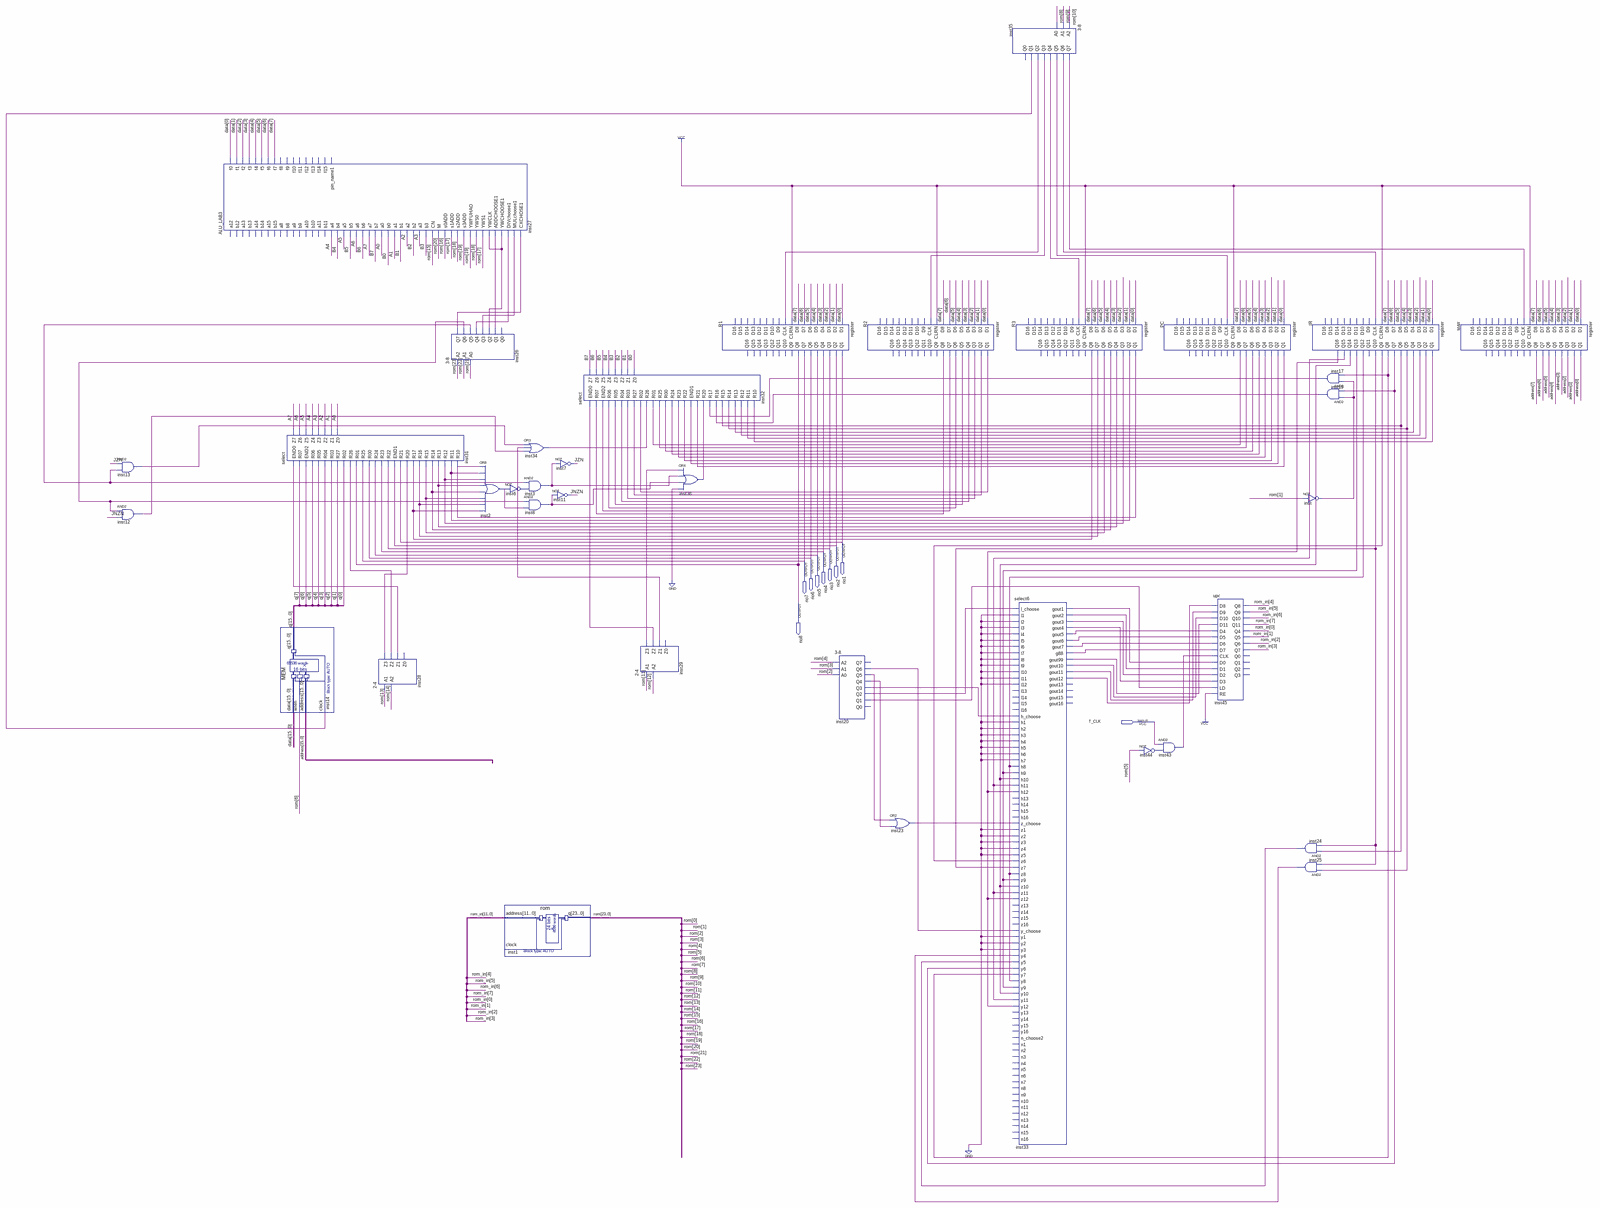
[diagram p0: schematic sheet, whole]
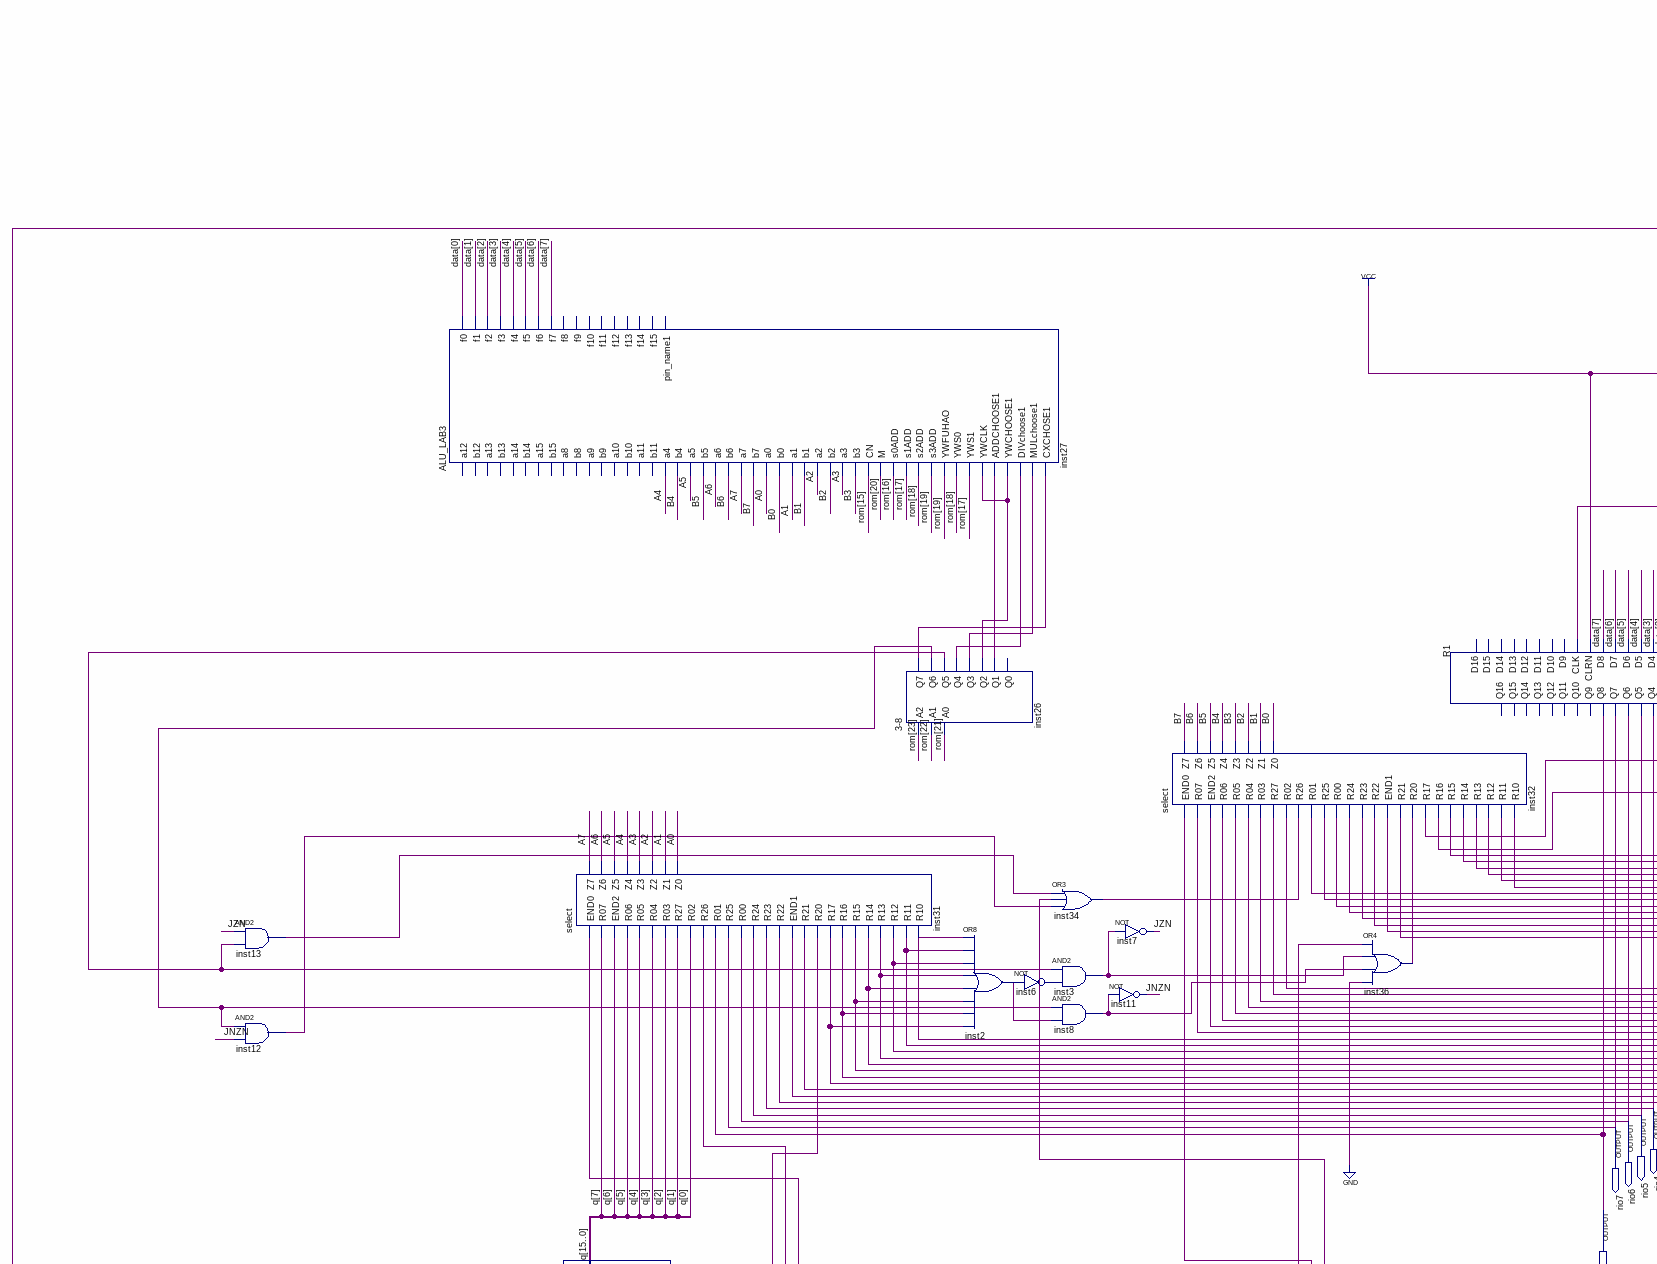
[diagram p1: schematic sheet, upper left part]
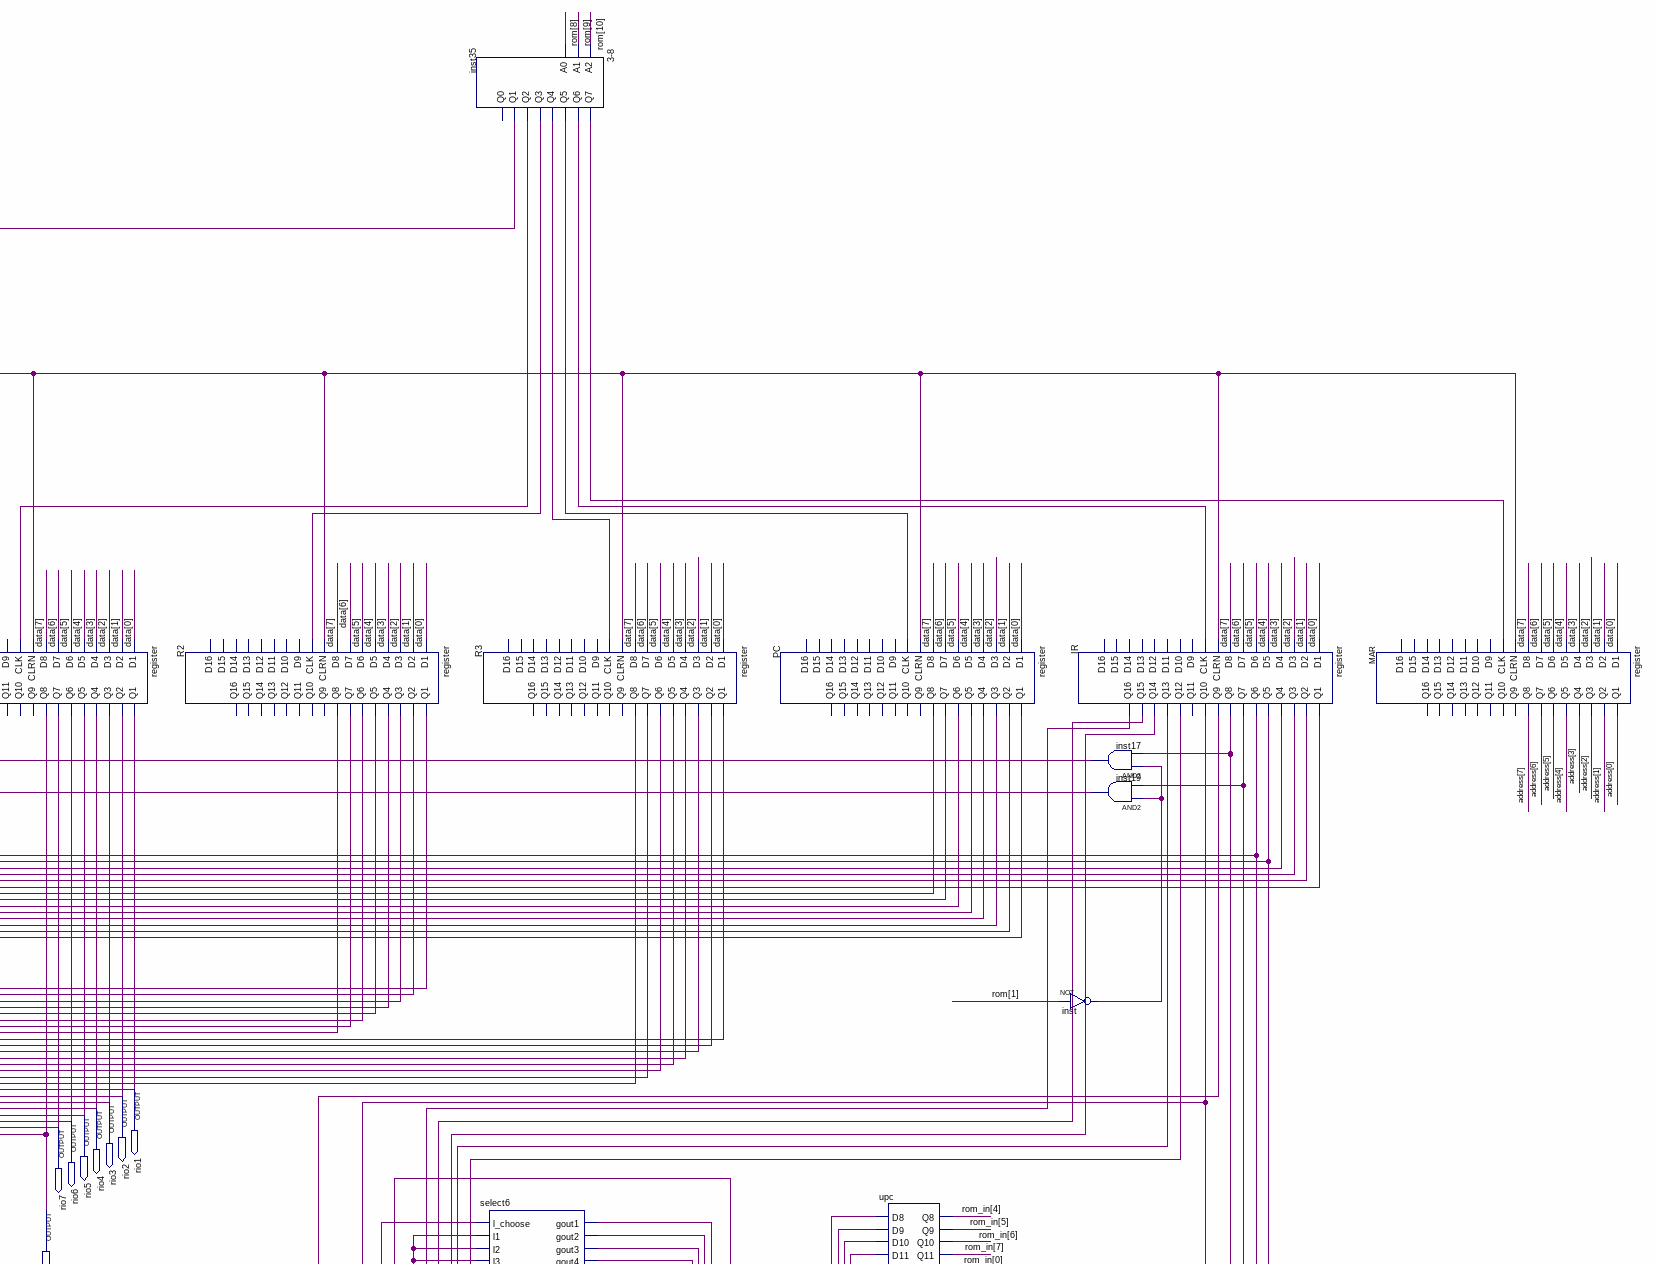
[diagram p2: schematic sheet, upper right part]
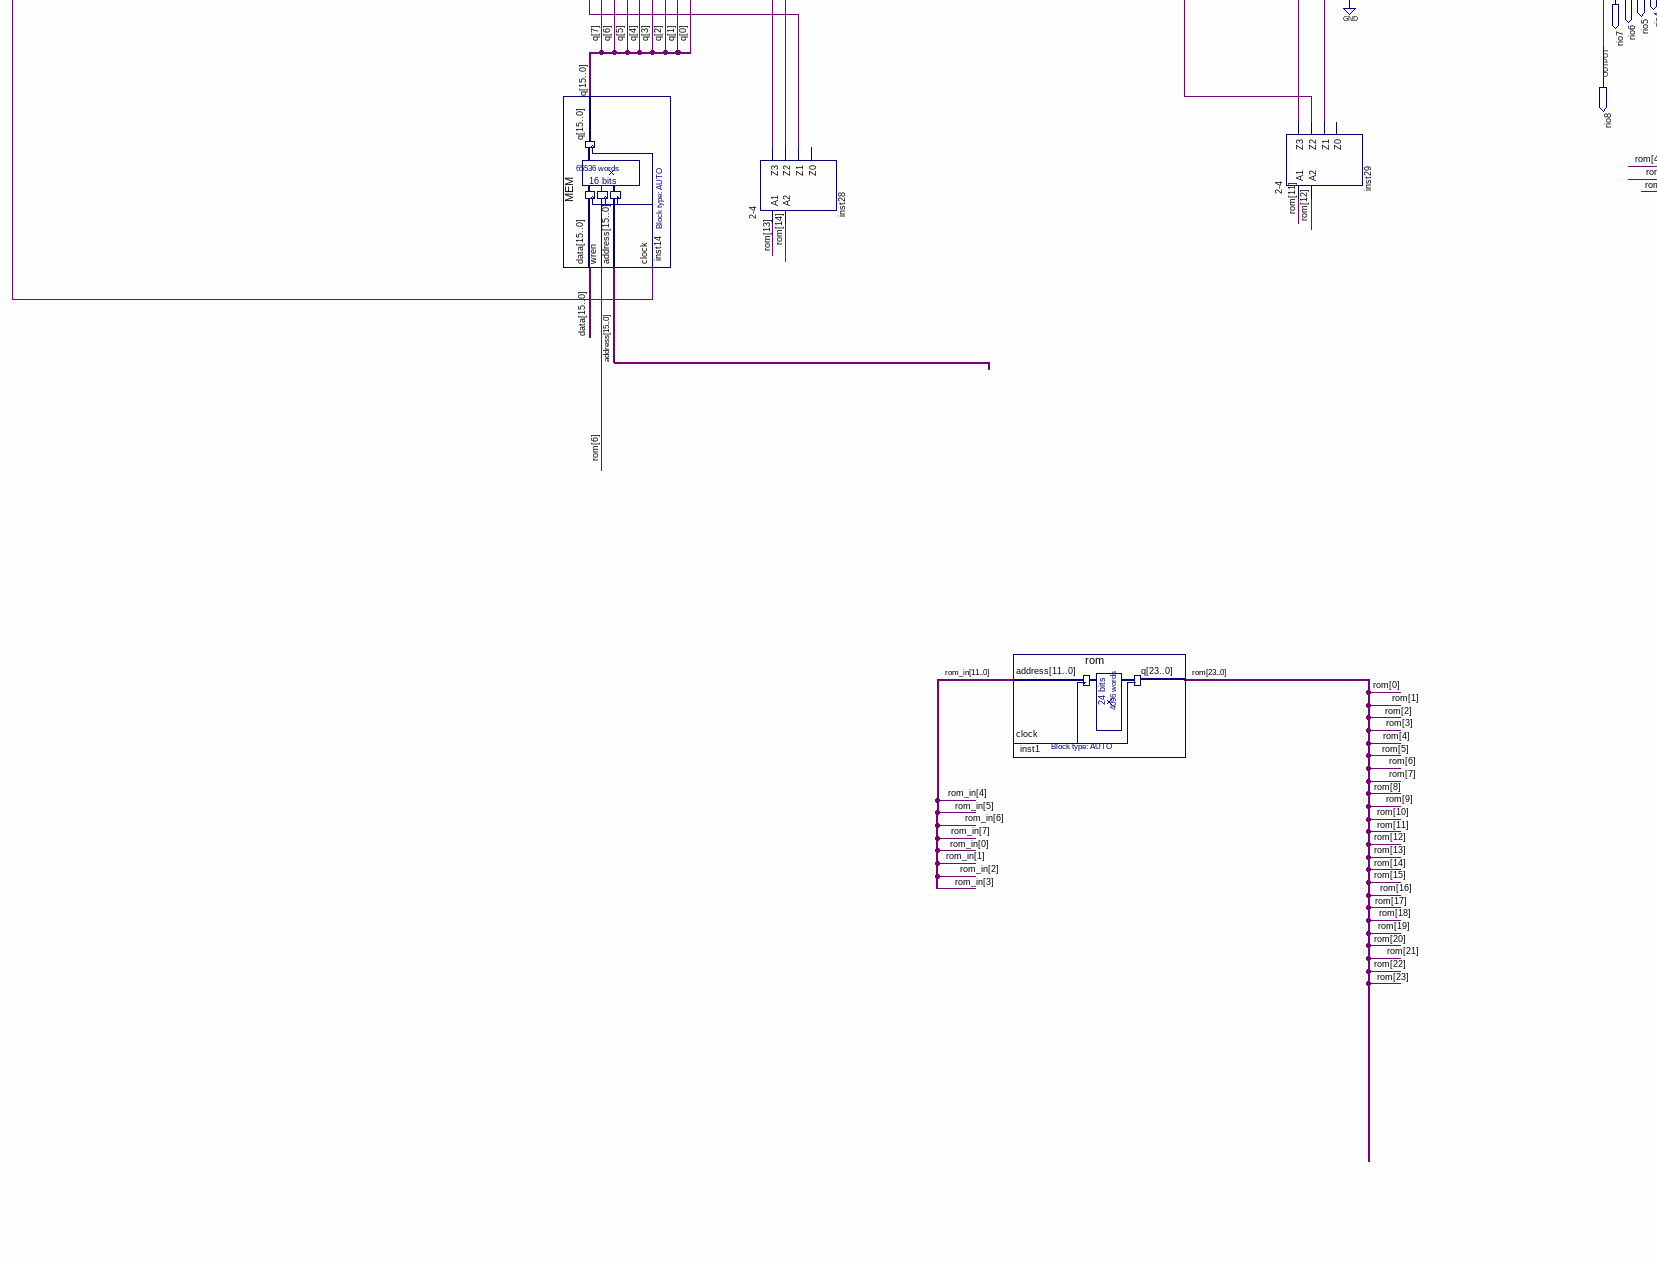
[diagram p3: schematic sheet, lower left part]
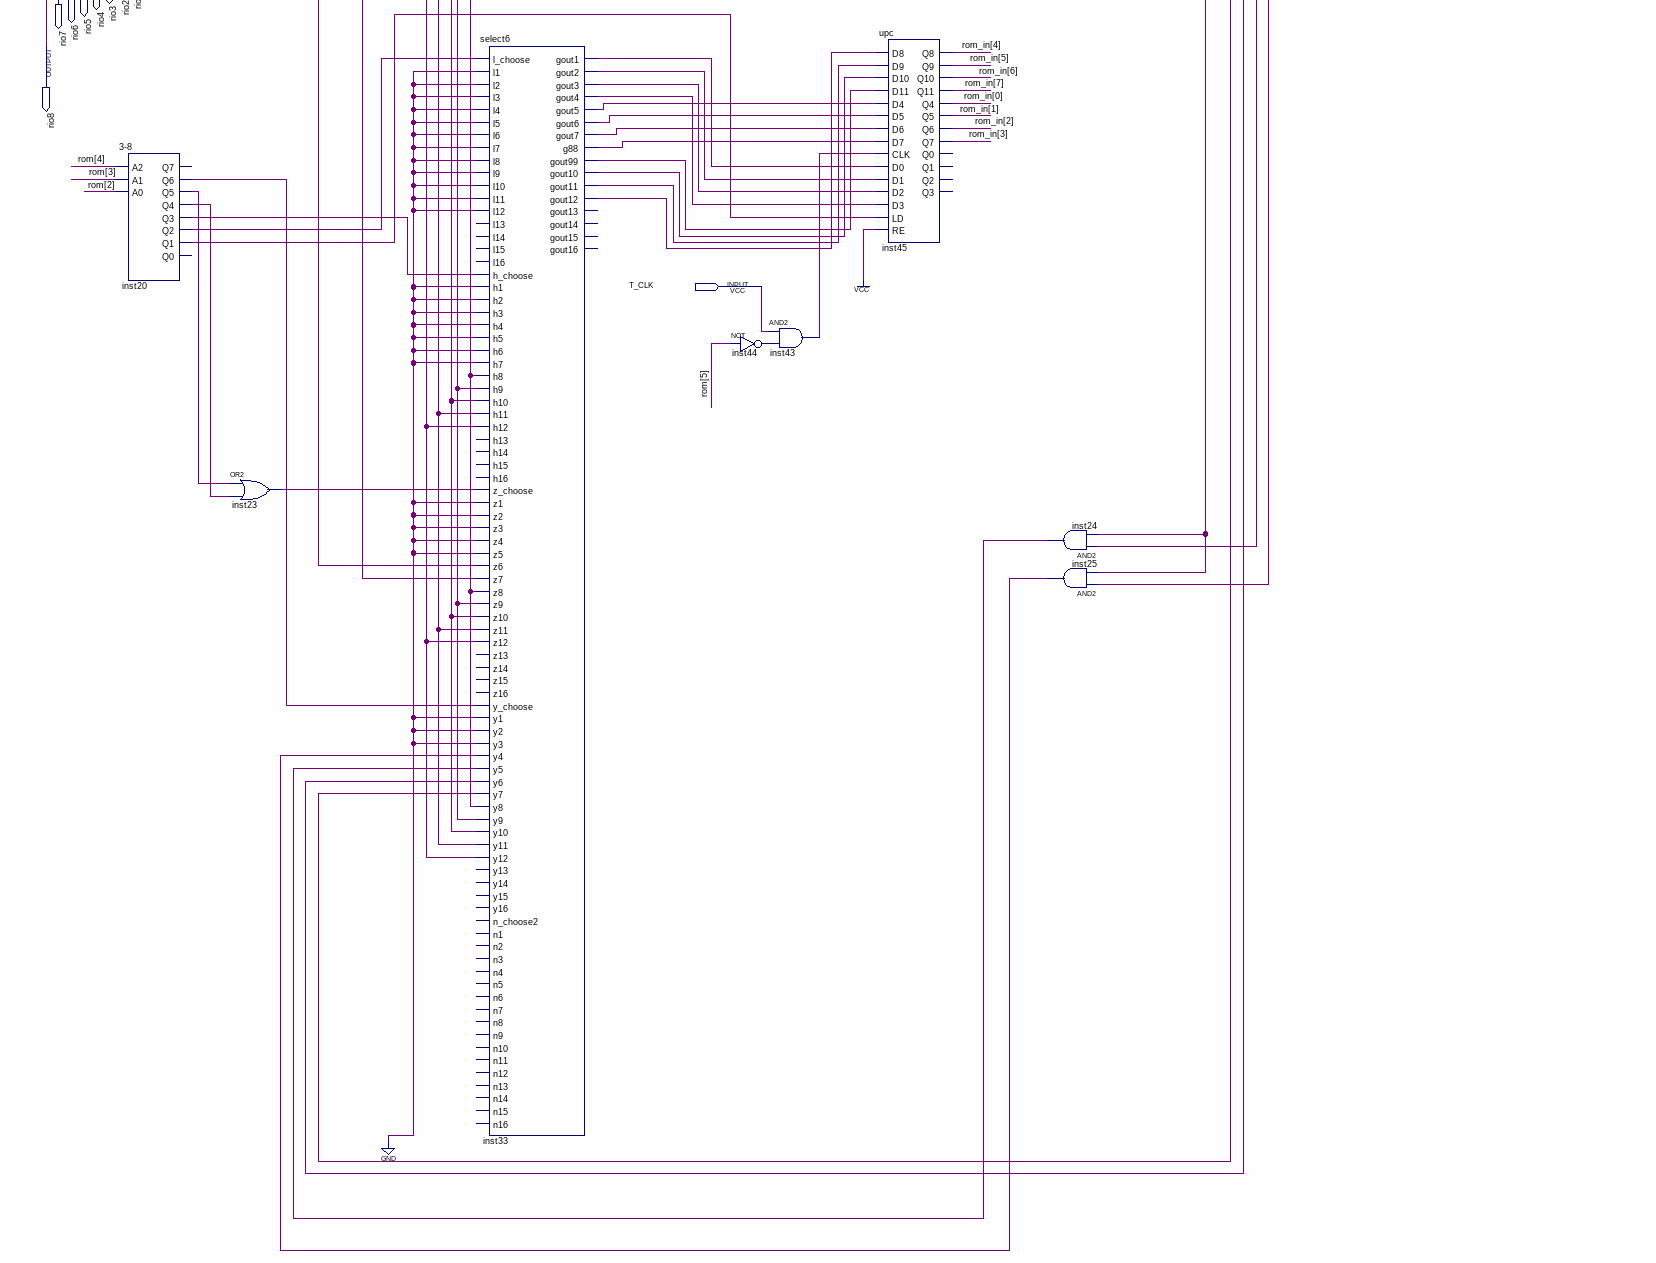
[diagram p4: schematic sheet, lower right part]
// Quartus schematic test3.bdf as structural Verilog: 36 symbols, 9 pins
module test3 (
  input  T_CLK,
  output rio1,
  output rio2,
  output rio3,
  output rio4,
  output rio5,
  output rio6,
  output rio7,
  output rio8
);

  wire A0, A1, A2, A3, A4, A5, A6, A7, B0, B1, B2, B3, B4, B5, B6, B7, inst2_out, inst3_out, inst6_out,
       inst8_out, inst12_out, inst13_out, inst17_out, inst19_out, inst20_q1, inst20_q2, inst20_q3, inst20_q4,
       inst20_q5, inst20_q6, inst23_out, inst24_out, inst25_out, inst26_q1, inst26_q2, inst26_q3, inst26_q4,
       inst26_q5, inst26_q6, inst26_q7, inst28_z1, inst28_z2, inst28_z3, inst29_z1, inst29_z2, inst29_z3,
       inst33_g88, inst33_gout1, inst33_gout2, inst33_gout3, inst33_gout4, inst33_gout5, inst33_gout6,
       inst33_gout7, inst33_gout10, inst33_gout11, inst33_gout12, inst33_gout99, inst34_out, inst35_q1,
       inst35_q2, inst35_q3, inst35_q4, inst35_q5, inst35_q6, inst35_q7, inst36_out, inst43_out, inst44_out,
       inst_out, IR_q1, IR_q2, IR_q3, IR_q4, IR_q5, IR_q6, IR_q7, IR_q8, IR_q9, IR_q10, IR_q12, IR_q13,
       IR_q14, IR_q15, IR_q16, JNZN, JZN, PC_q1, PC_q2, PC_q3, PC_q4, PC_q5, PC_q6, PC_q7, PC_q8, R2_q1,
       R2_q2, R2_q3, R2_q4, R2_q5, R2_q6, R2_q7, R2_q8, R3_q1, R3_q2, R3_q3, R3_q4, R3_q5, R3_q6, R3_q7,
       R3_q8;
  wire [11:0] rom_in;
  wire [15:0] address, data, q;
  wire [23:0] rom;

  and inst13 (inst13_out, JZN, inst26_q5);
  and inst12 (inst12_out, inst26_q6, JNZN);
  ALU_LAB3 inst27 (
    .a4(A4), .b4(B4), .a5(A5), .b5(B5), .a6(A6), .b6(B6), .a7(A7), .b7(B7), .a0(A0), .b0(B0), .a1(A1),
    .b1(B1), .a2(A2), .b2(B2), .a3(A3), .b3(B3), .CN(rom[15]), .M(rom[20]), .s0ADD(rom[16]), .s1ADD(rom[17]),
    .s2ADD(rom[18]), .s3ADD(rom[19]), .YWFUHAO(rom[19]), .YWS0(rom[18]), .YWS1(rom[17]), .YWCLK(inst26_q2),
    .ADDCHOOSE1(inst26_q1), .YWCHOOSE1(inst26_q2), .DIVchoose1(inst26_q4), .MULchoose1(inst26_q3),
    .CXCHOSE1(inst26_q7), .f0(data[0]), .f1(data[1]), .f2(data[2]), .f3(data[3]), .f4(data[4]), .f5(data[5]),
    .f6(data[6]), .f7(data[7]));  // open: a12, b12, a13, b13, a14, b14, a15, b15, a8, b8, a9, b9, a10, b10, a11, b11, f8, f9, f10, f11, f12, f13, f14, f15, pin_name1
  select inst31 (
    .END0(inst28_z1), .R07(q[7]), .END2(q[6]), .R06(q[5]), .R05(q[4]), .R04(q[3]), .R03(q[2]), .R27(q[1]),
    .R02(q[0]), .R26(inst28_z2), .R01(rio8), .R25(rio7), .R00(rio6), .R24(rio5), .R23(rio4), .R22(rio3),
    .END1(rio2), .R21(rio1), .R20(inst28_z3), .R17(R3_q8), .R16(R3_q7), .R15(R3_q6), .R14(R3_q5),
    .R13(R3_q4), .R12(R3_q3), .R11(R3_q2), .R10(R3_q1), .Z7(A7), .Z6(A6), .Z5(A5), .Z4(A4), .Z3(A3), .Z2(A2),
    .Z1(A1), .Z0(A0));
  MEM inst14 (.data(data), .wren(rom[6]), .address(address), .clock(inst35_q1), .q(q));
  \2-4  inst28 (.A1(rom[13]), .A2(rom[14]), .Z3(inst28_z3), .Z2(inst28_z2), .Z1(inst28_z1));  // open: Z0
  \3-8  inst26 (
    .A2(rom[23]), .A1(rom[22]), .A0(rom[21]), .Q7(inst26_q7), .Q6(inst26_q6), .Q5(inst26_q5), .Q4(inst26_q4),
    .Q3(inst26_q3), .Q2(inst26_q2), .Q1(inst26_q1));  // open: Q0
  or inst2 (inst2_out, R3_q1, R3_q2, R3_q3, R3_q4, R3_q5, R3_q6, R3_q7, R3_q8);
  not inst6 (inst6_out, inst2_out);
  rom inst1 (.address(rom_in), .q(rom));  // open: clock
  or inst34 (inst34_out, inst13_out, inst29_z1, inst12_out);
  and inst3 (inst3_out, inst26_q5, inst6_out);
  and inst8 (inst8_out, inst26_q6, inst2_out);
  not inst7 (JZN, inst3_out);
  not inst11 (JNZN, inst8_out);
  select inst32 (
    .END0(inst29_z2), .R07(R2_q8), .END2(R2_q7), .R06(R2_q6), .R05(R2_q5), .R04(R2_q4), .R03(R2_q3),
    .R27(R2_q2), .R02(R2_q1), .R26(inst34_out), .R01(PC_q8), .R25(PC_q7), .R00(PC_q6), .R24(PC_q5),
    .R23(PC_q4), .R22(PC_q3), .END1(PC_q2), .R21(PC_q1), .R20(inst36_out), .R17(inst17_out),
    .R16(inst19_out), .R15(IR_q6), .R14(IR_q5), .R13(IR_q4), .R12(IR_q3), .R11(IR_q2), .R10(IR_q1), .Z7(B7),
    .Z6(B6), .Z5(B5), .Z4(B4), .Z3(B3), .Z2(B2), .Z1(B1), .Z0(B0));
  \2-4  inst29 (.A1(rom[11]), .A2(rom[12]), .Z3(inst29_z3), .Z2(inst29_z2), .Z1(inst29_z1));  // open: Z0
  or inst36 (inst36_out, inst29_z3, inst3_out, inst8_out, 1'b0);
  register R1 (
    .D1(data[0]), .D2(data[1]), .D3(data[2]), .D4(data[3]), .D5(data[4]), .D6(data[5]), .D7(data[6]),
    .D8(data[7]), .CLRN(1'b1), .CLK(inst35_q2), .Q1(rio1), .Q2(rio2), .Q3(rio3), .Q4(rio4), .Q5(rio5),
    .Q6(rio6), .Q7(rio7), .Q8(rio8));  // open: D9, D10, D11, D12, D13, D14, D15, D16, Q9, Q10, Q11, Q12, Q13, Q14, Q15, Q16
  \3-8  inst20 (
    .A2(rom[4]), .A1(rom[3]), .A0(rom[2]), .Q6(inst20_q6), .Q5(inst20_q5), .Q4(inst20_q4), .Q3(inst20_q3),
    .Q2(inst20_q2), .Q1(inst20_q1));  // open: Q7, Q0
  register R2 (
    .D1(data[0]), .D2(data[1]), .D3(data[2]), .D4(data[3]), .D5(data[4]), .D6(data[5]), .D7(data[6]),
    .D8(data[7]), .CLRN(1'b1), .CLK(inst35_q3), .Q1(R2_q1), .Q2(R2_q2), .Q3(R2_q3), .Q4(R2_q4), .Q5(R2_q5),
    .Q6(R2_q6), .Q7(R2_q7), .Q8(R2_q8));  // open: D9, D10, D11, D12, D13, D14, D15, D16, Q9, Q10, Q11, Q12, Q13, Q14, Q15, Q16
  or inst23 (inst23_out, inst20_q5, inst20_q4);
  \3-8  inst35 (
    .A2(rom[10]), .A1(rom[9]), .A0(rom[8]), .Q7(inst35_q7), .Q6(inst35_q6), .Q5(inst35_q5), .Q4(inst35_q4),
    .Q3(inst35_q3), .Q2(inst35_q2), .Q1(inst35_q1));  // open: Q0
  register R3 (
    .D1(data[0]), .D2(data[1]), .D3(data[2]), .D4(data[3]), .D5(data[4]), .D6(data[5]), .D7(data[6]),
    .D8(data[7]), .CLRN(1'b1), .CLK(inst35_q4), .Q1(R3_q1), .Q2(R3_q2), .Q3(R3_q3), .Q4(R3_q4), .Q5(R3_q5),
    .Q6(R3_q6), .Q7(R3_q7), .Q8(R3_q8));  // open: D9, D10, D11, D12, D13, D14, D15, D16, Q9, Q10, Q11, Q12, Q13, Q14, Q15, Q16
  select6 inst33 (
    .l_choose(inst20_q2), .l1(1'b0), .l2(1'b0), .l3(1'b0), .l4(1'b0), .l5(1'b0), .l6(1'b0), .l7(1'b0),
    .l8(1'b0), .l9(1'b0), .l10(1'b0), .l11(1'b0), .l12(1'b0), .h_choose(inst20_q3), .h1(1'b0), .h2(1'b0),
    .h3(1'b0), .h4(1'b0), .h5(1'b0), .h6(1'b0), .h7(1'b0), .h8(IR_q12), .h9(IR_q13), .h10(IR_q14),
    .h11(IR_q15), .h12(IR_q16), .z_choose(inst23_out), .z1(1'b0), .z2(1'b0), .z3(1'b0), .z4(1'b0), .z5(1'b0),
    .z6(IR_q9), .z7(IR_q10), .z8(IR_q12), .z9(IR_q13), .z10(IR_q14), .z11(IR_q15), .z12(IR_q16),
    .y_choose(inst20_q6), .y1(1'b0), .y2(1'b0), .y3(1'b0), .y4(inst25_out), .y5(inst24_out), .y6(IR_q7),
    .y7(IR_q8), .y8(IR_q12), .y9(IR_q13), .y10(IR_q14), .y11(IR_q15), .y12(IR_q16), .gout1(inst33_gout1),
    .gout2(inst33_gout2), .gout3(inst33_gout3), .gout4(inst33_gout4), .gout5(inst33_gout5),
    .gout6(inst33_gout6), .gout7(inst33_gout7), .g88(inst33_g88), .gout99(inst33_gout99),
    .gout10(inst33_gout10), .gout11(inst33_gout11), .gout12(inst33_gout12));  // open: l13, l14, l15, l16, h13, h14, h15, h16, z13, z14, z15, z16, y13, y14, y15, y16, n_choose2, n1, n2, n3, n4, n5, n6, n7, n8, n9, n10, n11, n12, n13, n14, n15, n16, gout13, gout14, gout15, gout16
  not inst44 (inst44_out, rom[5]);
  register PC (
    .D1(data[0]), .D2(data[1]), .D3(data[2]), .D4(data[3]), .D5(data[4]), .D6(data[5]), .D7(data[6]),
    .D8(data[7]), .CLRN(1'b1), .CLK(inst35_q5), .Q1(PC_q1), .Q2(PC_q2), .Q3(PC_q3), .Q4(PC_q4), .Q5(PC_q5),
    .Q6(PC_q6), .Q7(PC_q7), .Q8(PC_q8));  // open: D9, D10, D11, D12, D13, D14, D15, D16, Q9, Q10, Q11, Q12, Q13, Q14, Q15, Q16
  and inst43 (inst43_out, T_CLK, inst44_out);
  upc inst45 (
    .D8(inst33_gout12), .D9(inst33_gout11), .D10(inst33_gout10), .D11(inst33_gout99), .D4(inst33_gout5),
    .D5(inst33_gout6), .D6(inst33_gout7), .D7(inst33_g88), .CLK(inst43_out), .D0(inst33_gout1),
    .D1(inst33_gout2), .D2(inst33_gout3), .D3(inst33_gout4), .LD(inst20_q1), .RE(1'b1), .Q8(rom_in[4]),
    .Q9(rom_in[5]), .Q10(rom_in[6]), .Q11(rom_in[7]), .Q4(rom_in[0]), .Q5(rom_in[1]), .Q6(rom_in[2]),
    .Q7(rom_in[3]));  // open: Q0, Q1, Q2, Q3
  register IR (
    .D1(data[0]), .D2(data[1]), .D3(data[2]), .D4(data[3]), .D5(data[4]), .D6(data[5]), .D7(data[6]),
    .D8(data[7]), .CLRN(1'b1), .CLK(inst35_q6), .Q1(IR_q1), .Q2(IR_q2), .Q3(IR_q3), .Q4(IR_q4), .Q5(IR_q5),
    .Q6(IR_q6), .Q7(IR_q7), .Q8(IR_q8), .Q9(IR_q9), .Q10(IR_q10), .Q12(IR_q12), .Q13(IR_q13), .Q14(IR_q14),
    .Q15(IR_q15), .Q16(IR_q16));  // open: D9, D10, D11, D12, D13, D14, D15, D16, Q11
  and inst17 (inst17_out, inst_out, IR_q8);
  and inst19 (inst19_out, inst_out, IR_q7);
  not inst (inst_out, rom[1]);
  and inst24 (inst24_out, IR_q6, IR_q10);
  and inst25 (inst25_out, IR_q5, IR_q10);
  register MAR (
    .D1(data[0]), .D2(data[1]), .D3(data[2]), .D4(data[3]), .D5(data[4]), .D6(data[5]), .D7(data[6]),
    .D8(data[7]), .CLRN(1'b1), .CLK(inst35_q7), .Q1(address[0]), .Q2(address[1]), .Q3(address[2]),
    .Q4(address[3]), .Q5(address[4]), .Q6(address[5]), .Q7(address[6]), .Q8(address[7]));  // open: D9, D10, D11, D12, D13, D14, D15, D16, Q9, Q10, Q11, Q12, Q13, Q14, Q15, Q16
endmodule
